# EasyEDA Pro project ProProject_扫描隧道显微镜OpenSTM_2023-09-09.epro, board ScannerMount
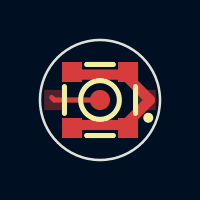
[diagram p10: board, top side]
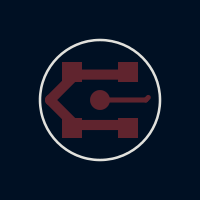
[diagram p11: board, bottom side, seen from below]

Outline 6 x 6 mm; copper layers: Top Layer, Bottom Layer. Coordinates in mm from the lower left corner of the outline.
Outline path: circle c3,3 r3
Stack: Top Layer 0.035mm / Dielectric1 1.51mm FR4 er 4.5 / Bottom Layer 0.035mm

## Design rules (mm)
spacing safeClearance (default): track to track 0.152, other pairs 0.152 to 0.3
track width trackWidth (default): min 0.127, default 0.254, max 2.54
differential pair differentialPair (default): width min 0.127, default 0.254, max 2.54; gap min 0.152, default 0.152
via viaSize (default): diameter min 0.5, default 0.61, max 10; hole min 0.3, default 0.305, max 6

## Placement (name value [footprint] x y rotation side)
RF1  KH-MMCX-KE-STM  [ANT-SMD_KH-MMCX-KE-STM]  3 3 0 top

## Footprints (pads in the part's own frame, mm; a bottom-side part is the same pattern mirrored in y, then rotated)
ANT-SMD_KH-MMCX-KE-STM
  rect 1x1 smd: 1(-1.4,1.4) 2(1.4,1.4) 3(1.4,-1.4) 4(-1.4,-1.4)
  round 1 smd: 5(0,0)

## Nets
As in the schematic.

## Routing (per net, layer and track width the routed paths; a pad name or vN(x,y) marks a point on that pad's centre or on a via; arc(x,y) is an arc through that point)
GND: length 8.5
  Top Layer w0.508: 1.75,1.75 4.25,1.75 5.49,2.99 5.49,3.01 4.23,4.27 1.77,4.27 1.75,4.25
SIG: length 2.5
  Top Layer w0.254: RF1.5 0.71,3 0.59,3.13

Small or netless copper shapes (teardrops, artwork), in the pictures only: 2 on Top Layer
